# EAGLE design final schematic (EAGLE 7.5.0)
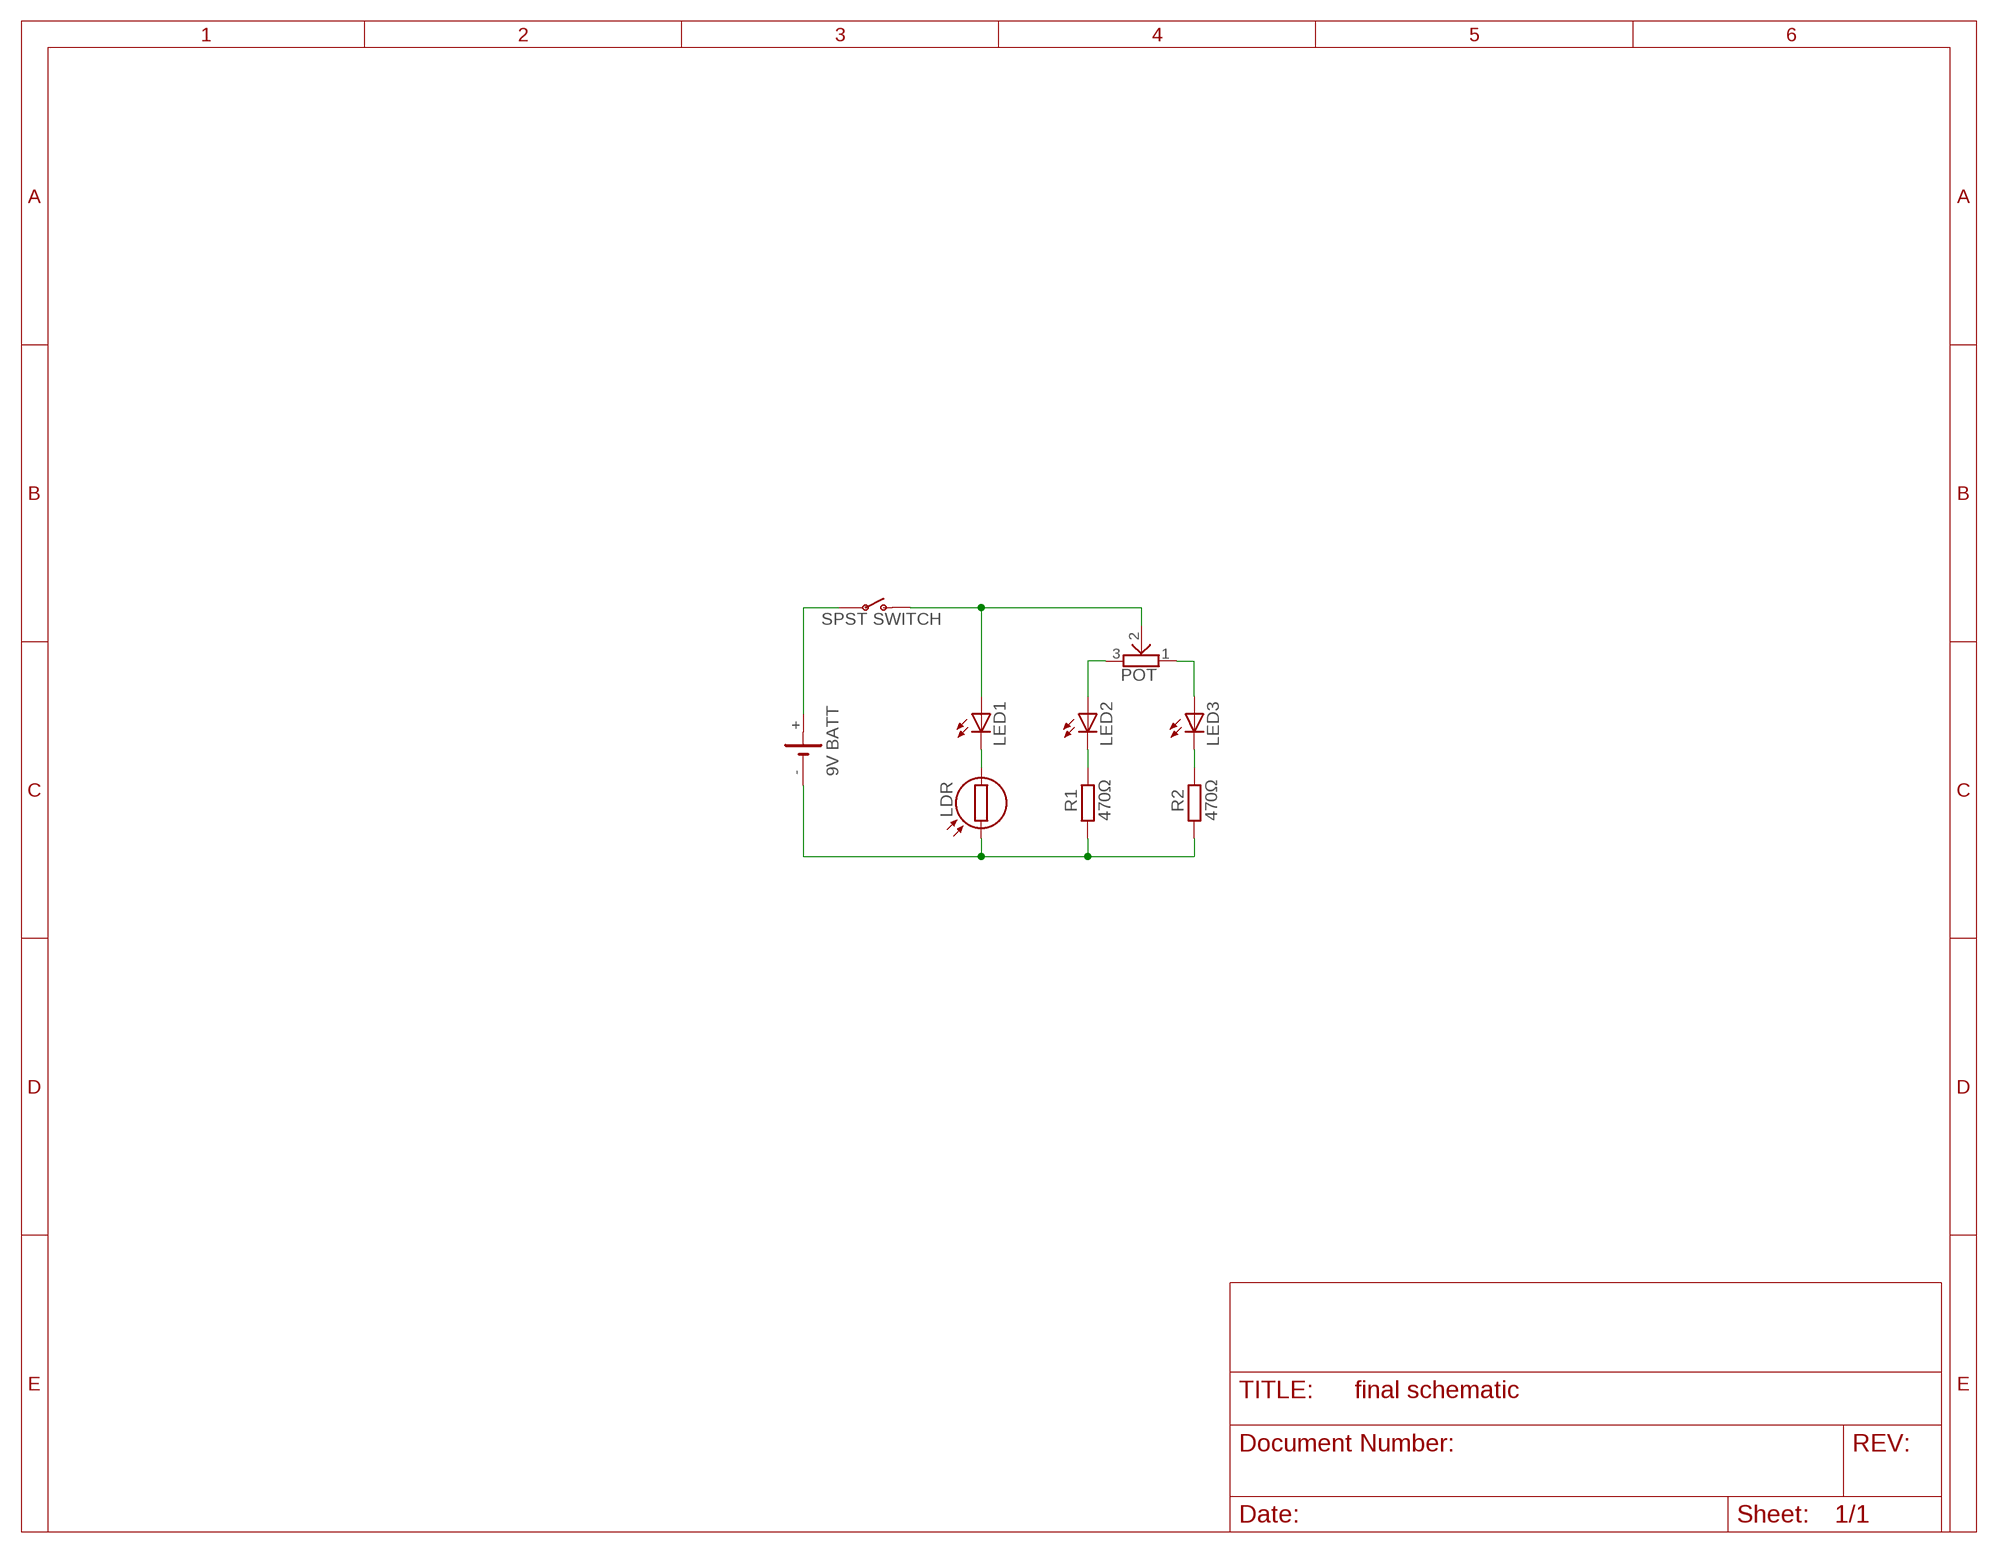
[diagram p0: schematic, sheet 1]

## Parts
G1  BATT_9V  [9V_CONNECTOR]
LDR  LDR_THRU  [LDR]
LED1  LED5MM  [LED5MM]
LED2  LED5MM  [LED5MM]
LED3  LED5MM  [LED5MM]
POT  POTENTIOMETER_THRU  [POTENTIOMETER_THRU]
R1  470Ω  R-EU_0207/10  [0207/10]
R2  470Ω  R-EU_0207/10  [0207/10]
U1  SWITCH-SPST-2TV  [SWITCH-SPST-VERTICAL]

## Nets
N$1: G1.- LDR.1 R1.1 R2.1
N$2: LED1.A POT.2 U1.1(O)
N$3: LDR.2 LED1.K(C)
N$5: LED3.K(C) R2.2
N$6: LED3.A POT.1
N$7: LED2.A POT.3
N$9: G1.+ U1.2(P)
N$10: LED2.K(C) R1.2

## Notes on the sheet
- SPST SWITCH
- 9V BATT

## Library data of the parts
G1 = personal:BATT_9V
LDR = personal:LDR_THRU
LED1-LED3 = adafruit:LED: LED OSRAM: - CHIPLED LG R971, LG N971, LY N971, LG Q971, LY Q971, LO R971, LY R971 LH N974, LH R974 LS Q976, LO Q976, LY Q976 LO Q996 - Hyper CHIPLED LW Q18S LB Q993, LB Q99A, LB R99A - SideLED LS A670, LO A670, LY A670, LG A670, LP A670 LB A673, LV A673, LT A673, LW A673 LH A674 LY A675 LS A676, LA A676, LO A676, LY A676, LW A676 LS A679, LY A679, LG A679 - Hyper Micro SIDELED® LS Y876, LA Y876, LO Y876, LY Y876 LT Y87S - SmartLED LW L88C, LW L88S LB L89C, LB L89S, LG L890 LS L89K, LO L89K, LY L89K LS L896, LA L896, LO L896, LY L896 - TOPLED LS T670, LO T670, LY T670, LG T670, LP T670 LSG T670, LSP T670, LSY T670, LOP T670, LYG T670 LG T671, LOG T671, LSG T671 LB T673, LV T673, LT T673, LW T673 LH T674 LS T676, LA T676, LO T676, LY T676, LB T676, LH T676, LSB T676, LW T676 LB T67C, LV T67C, LT T67C, LS T67K, LO T67K, LY T67K, LW E67C LS E67B, LA E67B, LO E67B, LY E67B, LB E67C, LV E67C, LT E67C LW T67C LS T679, LY T679, LG T679 LS T770, LO T770, LY T770, LG T770, LP T770 LB T773, LV T773, LT T773, LW T773 LH T774 LS E675, LA E675, LY E675, LS T675 LS T776, LA T776, LO T776, LY T776, LB T776 LHGB T686 LT T68C, LB T68C - Hyper Mini TOPLED® LB M676 - Mini TOPLED Santana® LG M470 LS M47K, LO M47K, LY M47K Source: http://www.osram.convergy.de/
POT = personal:POTENTIOMETER_THRU
R1 R2 = resistor:R-EU_: RESISTOR, European symbol
U1 = personal:SWITCH-SPST-2

## Board
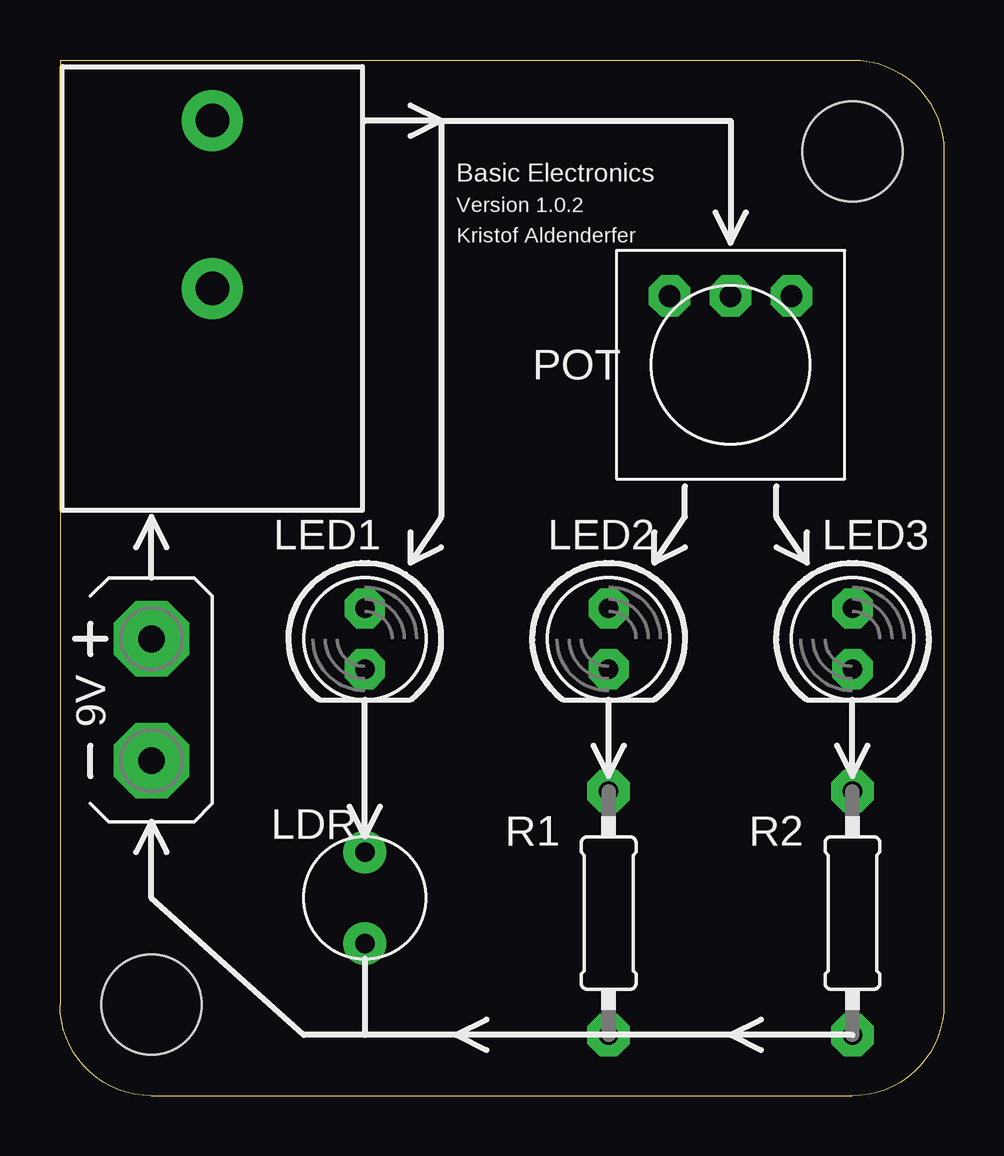
[diagram p1: board, top side]
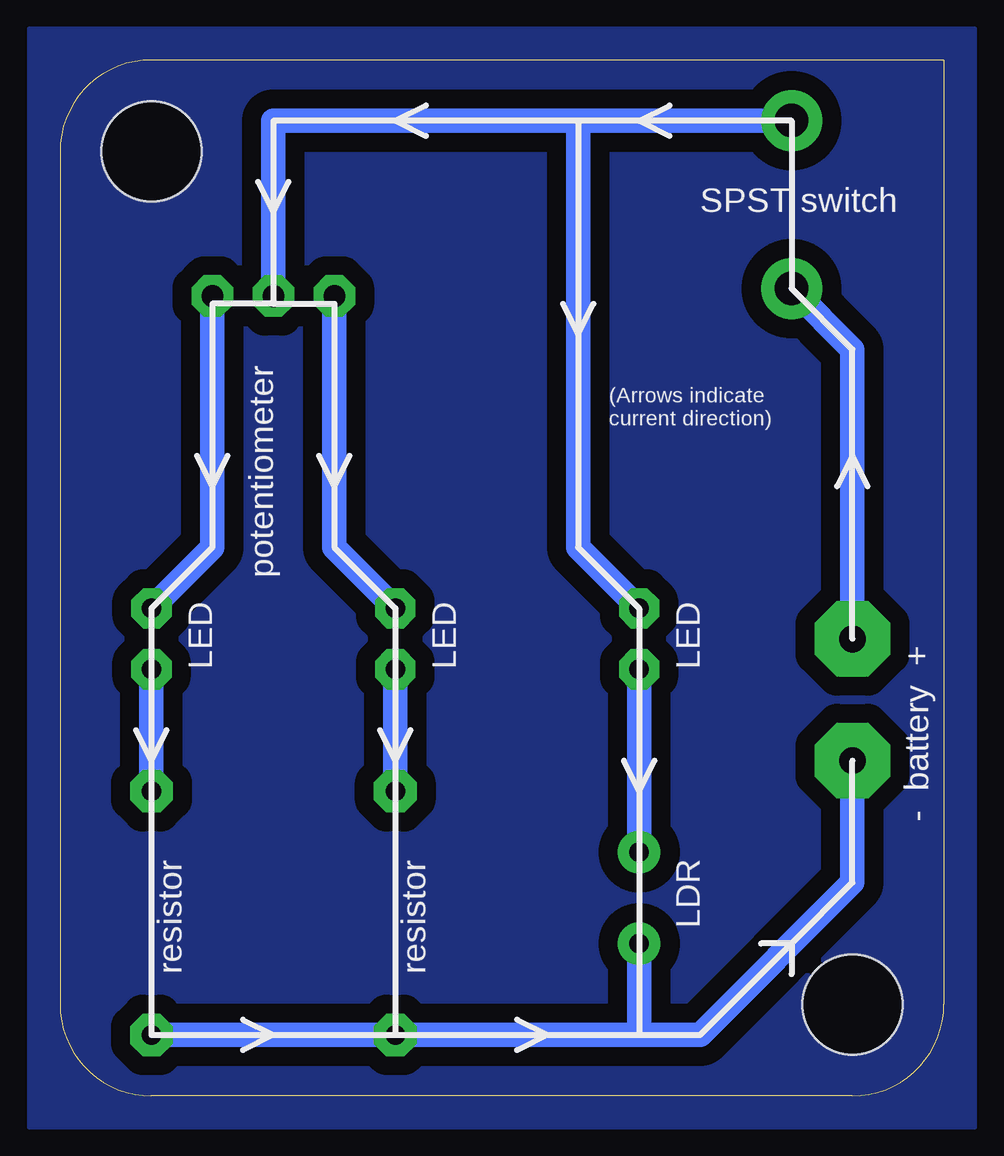
[diagram p2: board, bottom side, seen from below]

Size 36.83 x 43.18 mm. Coordinates in mm from the lower left corner, seen from the top.
Outline: 3.81,0 arc-90 0,3.81 0,43.18 33.02,43.18 arc-90 36.83,39.37 36.83,3.81 arc-90 33.02,0 3.81,0
Copper layers (1*16): Top 0.035mm / dielectric 1.5mm / Bottom 0.035mm
Design rules "Othermill-DRC-1-32": minimum track width 8mil, minimum drill 0.8mm, track to track 0.794003125mm, track to pad 0.794003125mm, pad to pad 0.794003125mm, via to via 0.794003125mm, smd to smd 0mil, copper to edge 0mil, drill to drill 1mil, minimum pad ring 10mil, minimum via ring 10mil, stop-mask expansion 1mil, vias tented up to drill 30mil, thermal gap 10mil
Holes 4.17 mm at 33.02,39.37 3.81,3.81

### Footprints (pad centres in the part's own frame; a part is rotated, then mirrored left to right if it is on the bottom)
9V_CONNECTOR = drill 1.118 pad 3.15 octagon: + 0,2.54; - 0,-2.54
LDR = drill 0.813 pad 1.778: 1 -1.905,0; 2 1.905,0
LED5MM = drill 0.813 pad 1.676 octagon: A -1.27,0; K 1.27,0
POTENTIOMETER_THRU = drill 0.9 pad 1.727 octagon: 1 -2.54,-2.857; 2 0,-2.857; 3 2.54,-2.857
0207/10 = drill 0.813 pad 1.778 octagon: 1 -5.08,0; 2 5.08,0
SWITCH-SPST-VERTICAL = drill 1.4 pad 2.54: 1 0,7; 2 0,0

### Placement (x,y rotation side)
G1  3.81,16.51 0 top
LDR  12.7,8.26 90 top
LED1  12.7,19.05 270 top
LED2  22.86,19.05 270 top
LED3  33.02,19.05 270 top
POT  27.94,30.48 180 top
R1  22.86,7.62 90 top
R2  33.02,7.62 90 top
U1  6.35,33.66 0 top

### Tracks (layer width: path | path; a pad name or v marks a point on that pad's centre or on a via)
N$1
  Bottom 1.016: R2.1 R1.1 12.7,2.54 | 12.7,2.54 10.16,2.54 3.81,8.89 G1.- | LDR.1 12.7,2.54
N$2
  Bottom 1.016: LED1.A 15.24,22.86 15.24,40.66 | U1.1 15.24,40.66 | 15.24,40.66 27.94,40.66 POT.2
N$3
  Bottom 1.016: LED1.K LDR.2
N$5
  Bottom 1.016: R2.2 LED3.K
N$6
  Bottom 1.016: LED3.A 30.48,22.86 POT.1
N$7
  Bottom 1.016: LED2.A 25.4,22.86 POT.3
N$8
  pour Bottom: 38.1,44.45 38.1,-1.27 -1.27,-1.27 -1.27,44.45
N$9
  Bottom 1.016: G1.+ 3.81,31.11 U1.2
N$10
  Bottom 1.016: LED2.K R1.2

### Text on the board
tPlace: Basic Electronics | Version 1.0.2 | Kristof Aldenderfer
bPlace: SPST switch | (Arrows indicate / current direction) | potentiometer | LED | LED | LED | - battery + | LDR | resistor | resistor